# Altium schematic sheet BuckBoost.SchDoc
size A4; SheetNumber: 3; SheetTotal: 13
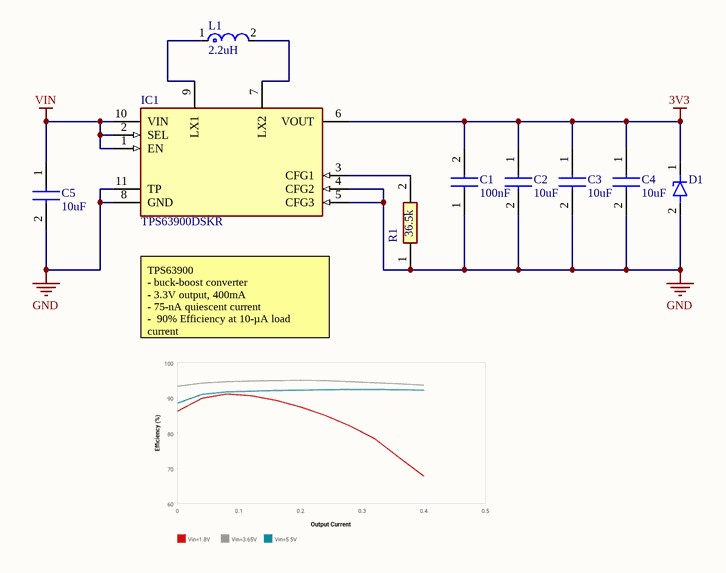
[diagram p0: BuckBoost.SchDoc]

## Parts
C1  100nF  [CAPC1005X70N]
C2  10uF  [GRM18x]
C3  10uF  [GRM18x]
C4  10uF  [GRM18x]
C5  10uF  [GRM18x]
D1  SP3205-01ETG  [SP320501ETG]  (value not drawn)
IC1  TPS63900DSKR  [SON50P250X250X80-11N-D]
L1  2.2uH  [FP-XFL4020-MFG]
R1  36.5k  [RESC1005X35N]

## Nets
3V3: C1.2 C2.1 C3.1 C4.1 D1.1(K) IC1.6(VOUT)
GND: C1.1 C2.2 C3.2 C4.2 C5.2 D1.2(A) IC1.4(CFG2) IC1.5(CFG3) IC1.8(GND) IC1.11(TP) R1.1
VIN: C5.1 IC1.1(EN) IC1.2(SEL) IC1.10(VIN)
NetIC1_3: IC1.3(CFG1) R1.2
NetIC1_7: IC1.7(LX2) L1.2
NetIC1_9: IC1.9(LX1) L1.1

## Notes on the sheet
- TPS63900
  - buck-boost converter
  - 3.3V output, 400mA
  - 75-nA quiescent current
  -  90% Efficiency at 10-µA load current
- Title:
- Date:
- Project:
- Type:
- Schematic
- Variant:
- Revision:
- Sheet
- of
- Author:
- Evžen Šteif
- Size:
- A4

## Library data of the parts
C1 = GRM155R61A104KA01D: Capacitor; Manufacturer_Name: Murata Electronics; Datasheet Link: https://search.murata.co.jp/Ceramy/image/img/A01X/G101/ENG/GRM155R61A104KA01-02A.pdf; Height: 0.7mm; Manufacturer_Part_Number: GRM155R61A104KA01D; Mouser Part Number: 81-GRM155R61A104KA01; Mouser Price/Stock: https://www.mouser.co.uk/ProductDetail/Murata-Electronics/GRM155R61A104KA01D?qs=5bAuhL3RhmNZw0v59AqOJA%3D%3D; Arrow Part Number: GRM155R61A104KA01D; Arrow Price/Stock: https://www.arrow.com/en/products/grm155r61a104ka01d/murata-manufacturing?utm_currency=USD&region=europe
C2-C5 = GRM188R61E106KA73D: Capacitor; Manufacturer_Name: Murata Electronics; Datasheet Link: https://search.murata.co.jp/Ceramy/image/img/A01X/G101/ENG/GRM188R61E106KA73-01A.pdf; Height: 0.9mm; Manufacturer_Part_Number: GRM188R61E106KA73D; Mouser Part Number: 81-GRM188R61E106KA3D; Mouser Price/Stock: https://www.mouser.co.uk/ProductDetail/Murata-Electronics/GRM188R61E106KA73D?qs=5aG0NVq1C4z8ebxPkQZf9A%3D%3D; Arrow Part Number: GRM188R61E106KA73D; Arrow Price/Stock: https://www.arrow.com/en/products/grm188r61e106ka73d/murata-manufacturing?region=nac
D1 = SP3205-01ETG: Diode ESD (Uni-directional); Manufacturer_Name: LITTELFUSE; Datasheet Link: https://4donline.ihs.com/images/VipMasterIC/IC/LFSI/LFSI-S-A0010724013/LFSI-S-A0010724013-1.pdf?hkey=6D3A4C79FDBF58556ACFDE234799DDF0; Height: 0.55mm; Manufacturer_Part_Number: SP3205-01ETG; Mouser Part Number: 576-SP3205-01ETG; Mouser Price/Stock: https://www.mouser.co.uk/ProductDetail/Littelfuse/SP3205-01ETG?qs=vHuUswq2%252BswfNhVD4WkB%252BQ%3D%3D; Arrow Part Number: SP3205-01ETG; Arrow Price/Stock: https://www.arrow.com/en/products/sp3205-01etg/littelfuse?utm_currency=USD&region=nac
IC1 = TPS63900DSKR: Integrated Circuit; Manufacturer_Name: Texas Instruments; Datasheet Link: https://www.ti.com/lit/gpn/tps63900?HQS=ti-null-null-sf-df-pf-sep-wwe&DCM=yes; Height: 0.8mm; Manufacturer_Part_Number: TPS63900DSKR; Mouser Part Number: 595-TPS63900DSKR; Mouser Price/Stock: https://www.mouser.co.uk/ProductDetail/Texas-Instruments/TPS63900DSKR?qs=zW32dvEIR3tSAmS5hXaH1Q%3D%3D; Arrow Part Number: TPS63900DSKR; Arrow Price/Stock: https://www.arrow.com/en/products/tps63900dskr/texas-instruments?utm_currency=USD&region=nac
L1 = CMP-2000-05090-4: INDUCTOR, 2.2UH, 8A, 20%, 38MHZ, REEL; Test Frequency: 100kHz; Shielding: Shielded; Saturation Current: 3.1A; DC Resistance (DCR): 23.5mR; Core Material: Composite; Height: 2.1mm; Width: 4.3mm; Mount: Surface Mount; RMS Current (Irms): 8A; Case/Package: SMD/SMT; Length: 4.3mm; REACH SVHC: No SVHC; Max DC Current: 8A; Min Operating Temperature: -40°C; Series: XFL4020; Self Resonant Frequency: 38MHz; Inductance Tolerance: 20%; Lead Free: Contains Lead; Tolerance: 20%; RoHS Compliant: Yes; Termination: SMD/SMT; Packaging: Tape and Reel; Max Operating Temperature: 125°C; Inductance: 2.2uH
R1 = RP0402BRD0736K5L: Resistor; Manufacturer_Name: KEMET; Datasheet Link: https://cz.mouser.com/datasheet/2/447/PYu_RP_51_RoHS_L_3-3461456.pdf; Height: 0.35mm; Manufacturer_Part_Number: RP0402BRD0736K5L; Mouser Part Number: 603-RT0402FRE07100KL; Mouser Price/Stock: https://www.mouser.co.uk/ProductDetail/YAGEO/RT0402FRE07100KL?qs=BXCcY9r%252B08CxTvf5JB1kiw%3D%3D; Arrow Part Number: RT0402FRE07100KL; Arrow Price/Stock: https://www.arrow.com/en/products/rt0402fre07100kl/yageo